# EAGLE schematic USB-HID-micro_new (EAGLE 5.11)
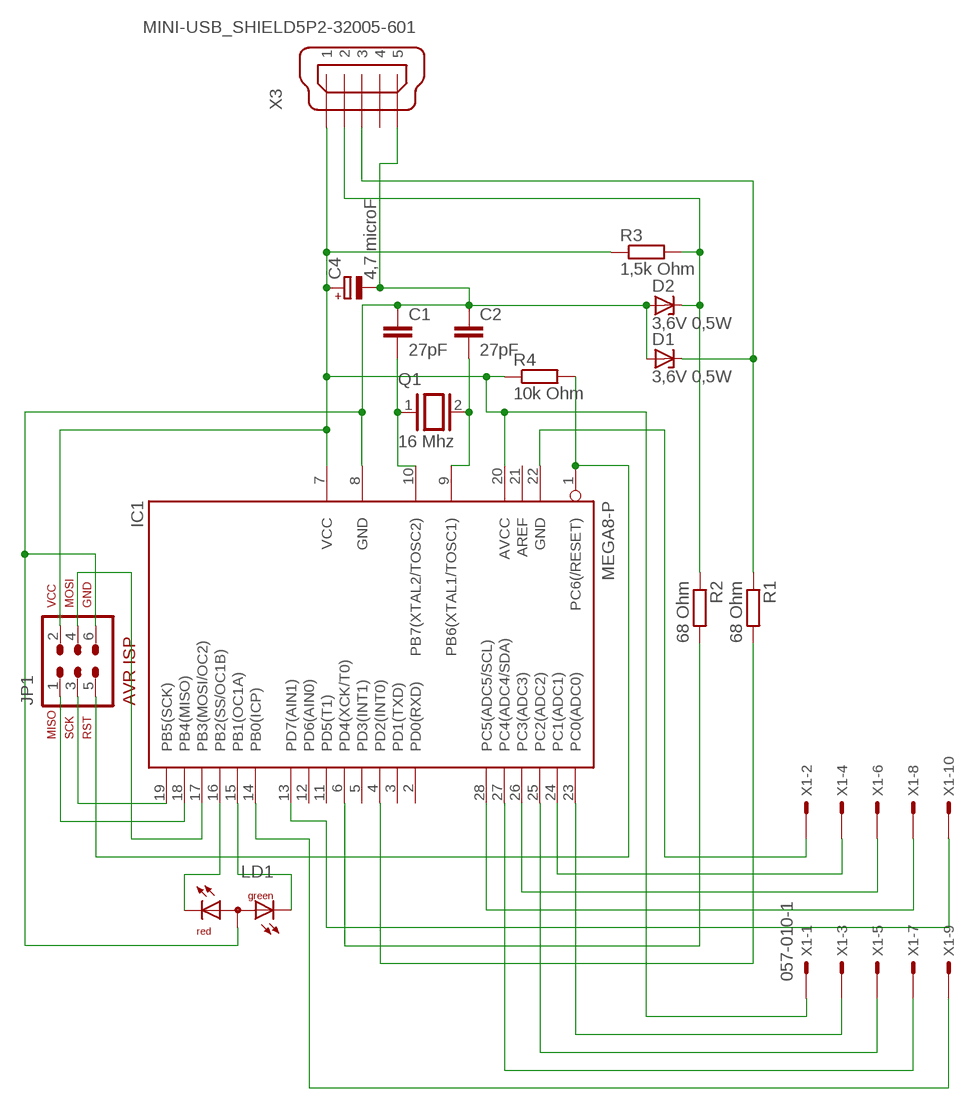
[diagram p0: schematic, sheet 1]

## Parts
C1  27pF  C2.5/2  [C2.5-2]
C2  27pF  C2.5/2  [C2.5-2]
C4  4,7 microF  CPOL-EUE1.8-4  [E1,8-4]
D1  3,6V 0,5W  ZPD  [DO35Z10]
D2  3,6V 0,5W  ZPD  [DO35Z10]
IC1  MEGA8-P  [DIL28-3]
JP1  AVR-ISP-6VERT  [AVR-ISP-6]
LD1  DUOLED-RG-A  [DUOLED-A-5MM]
Q1  16 Mhz  XTAL/S  [QS]
R1  68 Ohm  R-EU_0204/7  [0204/7]
R2  68 Ohm  R-EU_0204/7  [0204/7]
R3  1,5k Ohm  R-EU_0204/7  [0204/7]
R4  10k Ohm  R-EU_0204/7  [0204/7]
X1  057-010-1  [057-010-1]
X3  MINI-USB_SHIELD5P2-32005-601  [32005-601]

## Nets
AGND: IC1.22(GND) X1.2
GND: C1.1 C2.1 C4.- D1.A D2.A IC1.8(GND) JP1.6 LD1.A X3.5
N$4: D2.C R2.1 R3.2 X3.2
N$21: D1.C R1.1 X3.3
PB0: IC1.14(PB0(ICP)) X1.9
PB1: IC1.15(PB1(OC1A)) LD1.CX(CG)
PB2: IC1.16(PB2(SS/OC1B)) LD1.CR
PB3(MOSI): IC1.17(PB3(MOSI/OC2)) JP1.4
PB4(MISO): IC1.18(PB4(MISO)) JP1.1
PB5(SCK): IC1.19(PB5(SCK)) JP1.3
PB6(XTAL1): C2.2 IC1.9(PB6(XTAL1/TOSC1)) Q1.2
PB7(XTAL2): C1.2 IC1.10(PB7(XTAL2/TOSC2)) Q1.1
PC0: IC1.23(PC0(ADC0)) X1.3
PC1: IC1.24(PC1(ADC1)) X1.4
PC2: IC1.25(PC2(ADC2)) X1.5
PC3: IC1.26(PC3(ADC3)) X1.6
PC4: IC1.27(PC4(ADC4/SDA)) X1.7
PC5: IC1.28(PC5(ADC5/SCL)) X1.8
PC6(RESET): IC1.1(PC6(/RESET)) JP1.5 R4.2
PD7: IC1.13(PD7(AIN1)) X1.10
USB_D+: IC1.4(PD2(INT0)) R1.2
USB_D-: IC1.6(PD4(XCK/T0)) R2.2
VCC: C4.+ IC1.7(VCC) IC1.20(AVCC) JP1.2 R3.1 R4.1 X1.1 X3.1
Unconnected: IC1.2(PD0(RXD)) IC1.3(PD1(TXD)) IC1.5(PD3(INT1)) IC1.11(PD5(T1)) IC1.12(PD6(AIN0)) IC1.21(AREF) X3.4 X3.M1(S1) X3.M2(S2)

## Library data of the parts
C1 C2 = capacitor-wima:C: CAPACITOR naming: grid - package width
C4 = rcl:CPOL-EU: POLARIZED CAPACITOR, European symbol
D1 D2 = diode:ZPD: Z DIODE 500 mW
IC1 = atmel:MEGA8-P: MICROCONTROLLER 8 Kbytes FLASH, 1 kbytes SRAM, 512 bytes EEPROM, USART, 4-channel 10 bit ADC, 2-channel 8 bit ADC Pin compatible with Atmega48, ATMega88, ATMega168 Source: avr.lbr; OC_FARNELL: unknown; OC_NEWARK: unknown
JP1 = avr-7:AVR-ISP-6: AVR ISP-6 Serial Programming Header
LD1 = led:DUOLED-RG-A: DUO LED 2 colors (red/green), 5 mm, round, common Anode www.ligitek.com or other producers.
Q1 = special:XTAL/S: CRYSTAL
R1-R4 = resistor:R-EU_: RESISTOR, European symbol
X1 = con-panduit:057-010-: CONNECTOR 10-pin series 057 contact pc board low profile headers; OC_FARNELL: unknown; OC_NEWARK: unknown
X3 = con-cypressindustries:MINI-USB_SHIELD5P2-: MINI USB-B R/A DIP 5pol. Source: www.cypressindustries.com; OC_FARNELL: unknown; OC_NEWARK: unknown